# Altium schematic sheet Photocoupler12Vinput.SchDoc
size B; Author: AM; CompanyName: Expatria Technologies; DrawnBy: A.Marles; Engineer: AM; Organization: Expatria Technologies; DocumentNumber: 8; Revision: A1; SheetNumber: 8; SheetTotal: 14; PCB_Rev: A1
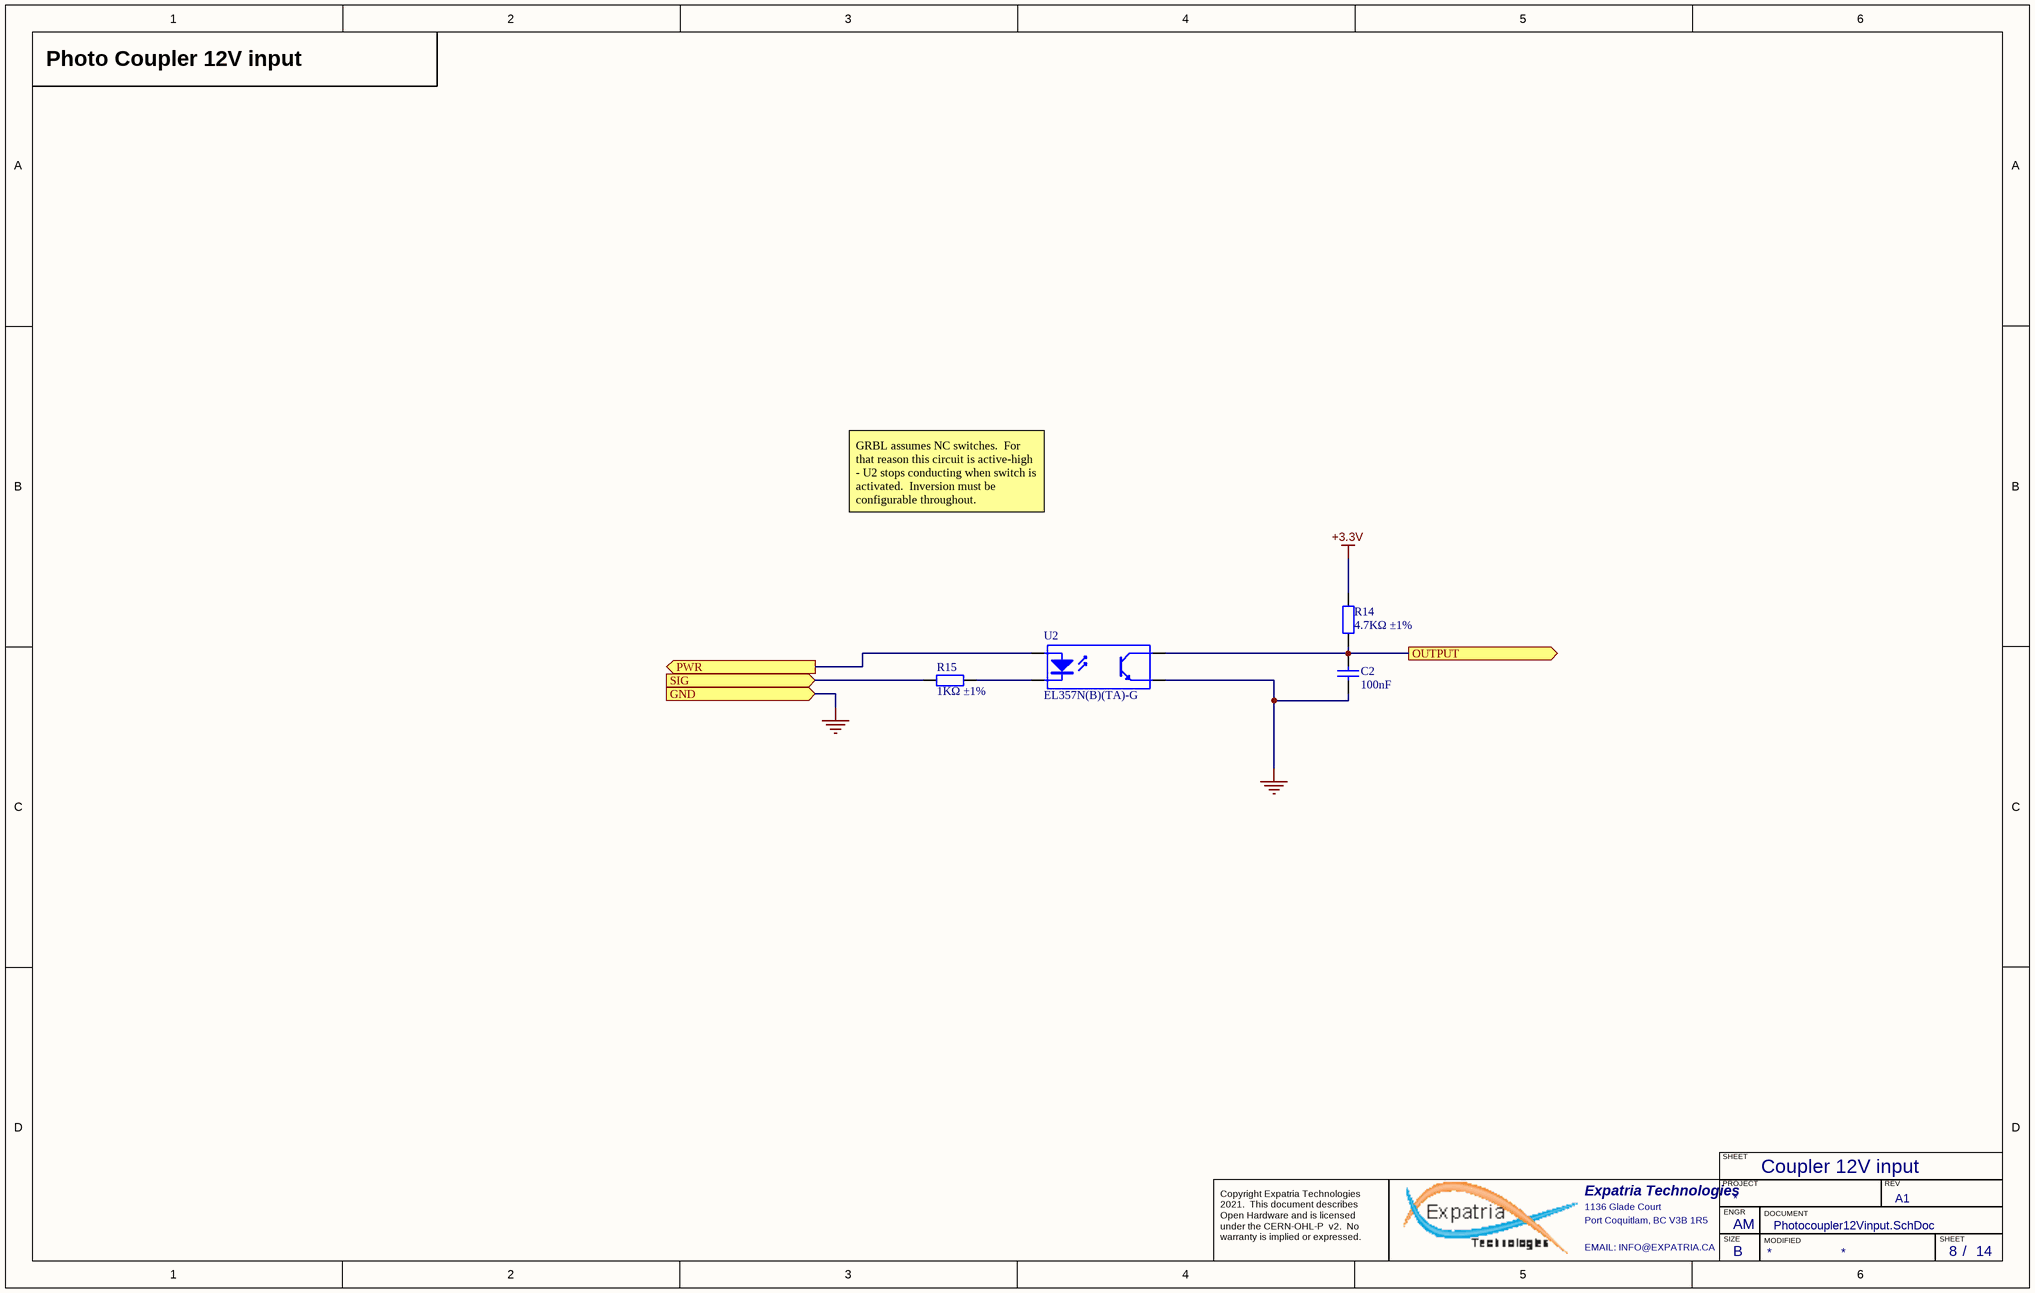
[diagram p0: Photocoupler12Vinput.SchDoc]

## Parts
C2  100nF  [0402_C]
R14  4.7KΩ ±1%  [0402_R]
R15  1KΩ ±1%  [0402_R]
U2  EL357N(B)(TA)-G  [SOP-4_P2.54]

## Ports
GND (in), OUTPUT (out), PWR (out), SIG (in)

## Nets
+3.3V: R14.2
GND: C2.1 U2.3(E) ; port GND
OUTPUT: C2.2 R14.1 U2.4(C) ; port OUTPUT
PWR: U2.1(A) ; port PWR
SIG: R15.1 ; port SIG
NetR15_2: R15.2 U2.2(K)

## Notes on the sheet
- Photo Coupler 12V input
- GRBL assumes NC switches.  For that reason this circuit is active-high - U2 stops conducting when switch is activated.  Inversion must be configurable throughout.
- Coupler 12V input
- SHEET
- Expatria Technologies
- 1136 Glade Court
- Port Coquitlam, BC V3B 1R5
- PROJECT
- SIZE
- ENGR
- MODIFIED
- DOCUMENT
- REV
- Copyright Expatria Technologies 2021.  This document describes Open Hardware and is licensed under the CERN-OHL-P  v2.  No warranty is implied or expressed.
- EMAIL: INFO@EXPATRIA.CA
- B
- /

## Library data of the parts
C2 = 0402 100nF (104) 10% 16V: Chip capacitors; Manufacturer: Samsung Electro-Mechanics; PartNumber: CL05B104KO5NNNC; Tolerance: 10%; Voltage: 16V; Package: 0402; Supplier: LC; SuppliersPartNumber: C1525; Capacitance: 100nF
R14 = 0402 4.7K (4701) 1%: Chip resistor; Manufacturer: Uniroyal Elec; PartNumber: 0402WGF4701TCE; Power: 1/16W; Package: 0402; Supplier: LC; SuppliersPartNumber: C25900; Resistance: 4.7KΩ; Tolerance: 1%
R15 = 0402 1K (1001) 1%: Chip resistor; Manufacturer: Uniroyal Elec; PartNumber: 0402WGF1001TCE; Power: 1/16W; Package: 0402; Supplier: LC; SuppliersPartNumber: C11702; Resistance: 1KΩ; Tolerance: 1%
U2 = EL357N(B)(TA)-G_[C6649]: 贴片光耦; Package: SOP-4_P2.54; Supplier: LC; SuppliersPartNumber: C6649